# Altium schematic sheet Led&Speaker.SchDoc
size A
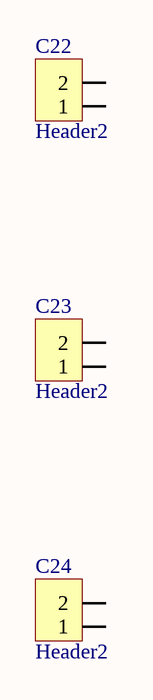
[diagram p0: Led&Speaker.SchDoc]

## Parts
C22  Header2  [Header2]
C23  Header2  [Header2]
C24  Header2  [Header2]

## Nets

Not connected (* = marked no-connect by the designer): C22 1 2; C23 1 2; C24 1 2

## Library data of the parts
C22-C24 = Header2: Header IDC, 2 x 1 Pin Vertical 2.54mm Pitch (Non-Boxed, Male); Manufacturer: W¨¹rth Elektronik eiSos GmbH; partNo: 613002143121; ComponentLink1 Description: Manufacturer; ComponentLink2 Description: Datasheet; NoPins: 02; Created Date: 29 March 2013; ComponentLink1URL: http://www.we-online.com; ComponentLink2URL: http://katalog.we-online.de/em/datasheet/6130xx143121.pdf; Created by: Karrer Zheng